# EAGLE design emonPi_v2.0.0-beta (EAGLE 9.6.2)
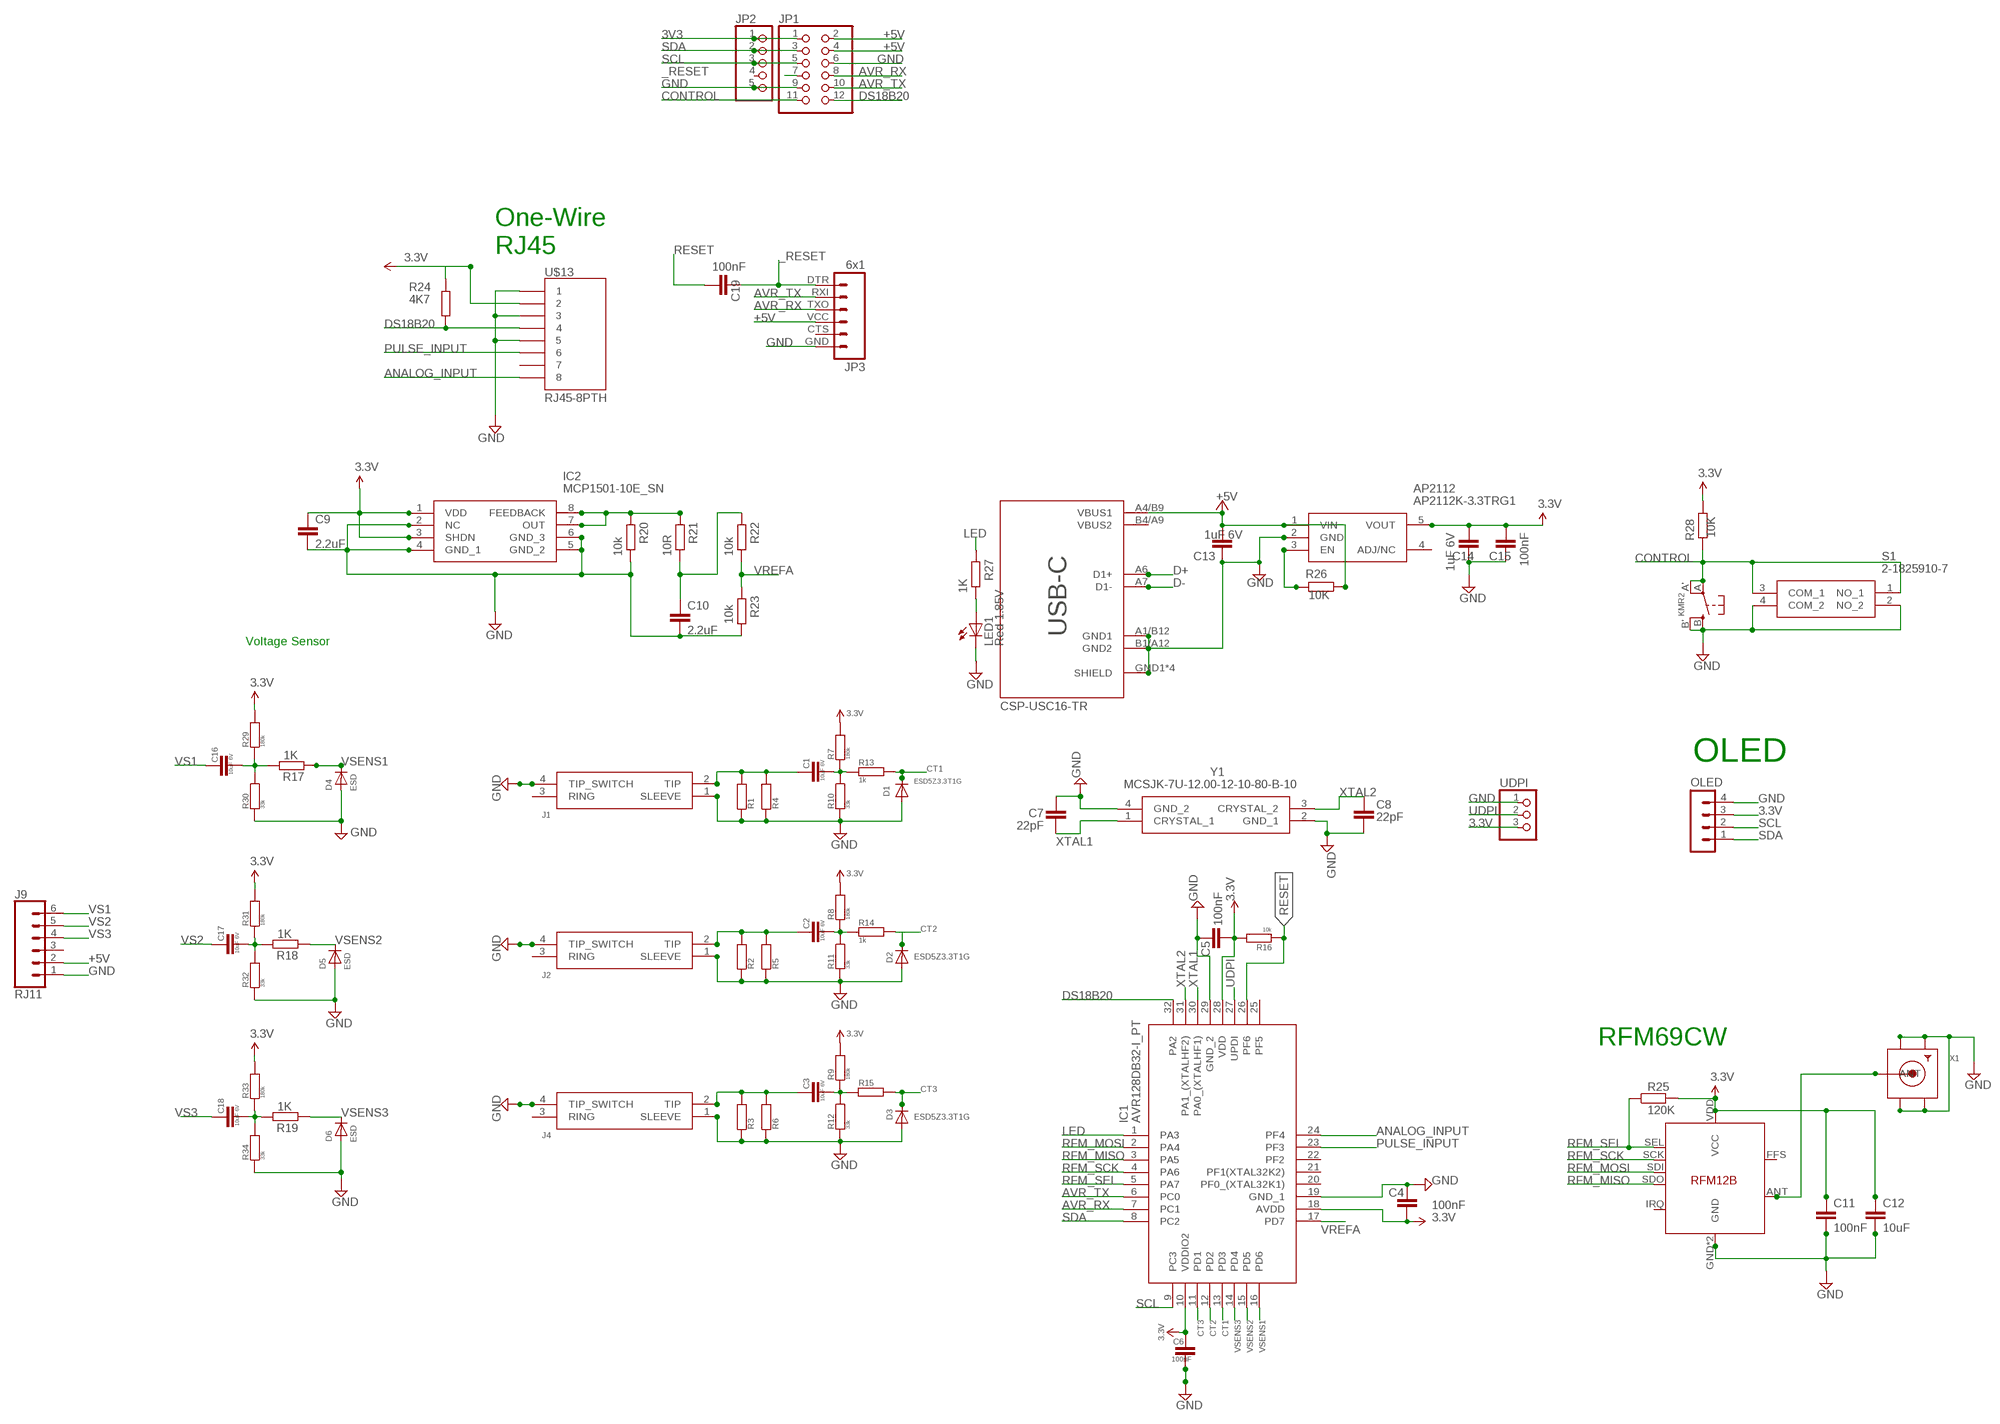
[diagram p0: schematic, sheet 1]

## Parts
AP2112  AP2112K-3.3TRG1  [SOT95P282X130-5N]
C1  10uF 6V  C-EUC0603  [C0603]
C2  10uF 6V  C-EUC0603  [C0603]
C3  10uF 6V  C-EUC0603  [C0603]
C4  100nF  C-EUC0603  [C0603]
C5  100nF  C-EUC0603  [C0603]
C6  100nF  C-EUC0603  [C0603]
C7  22pF  C-EUC0603  [C0603]
C8  22pF  C-EUC0603  [C0603]
C9  2.2uF  C-EUC0603  [C0603]
C10  2.2uF  C-EUC0603  [C0603]
C11  100nF  C-EUC0603  [C0603]
C12  10uF  C-EUC0603  [C0603]
C13  1uF 6V  C-EUC0603  [C0603]
C14  1uF 6V  C-EUC0603  [C0603]
C15  100nF  C-EUC0603  [C0603]
C16  10uF 6V  C-EUC0603  [C0603]
C17  10uF 6V  C-EUC0603  [C0603]
C18  10uF 6V  C-EUC0603  [C0603]
C19  100nF  C-EUC0603  [C0603]
CTRL  KMR2  SWITCH_TACT_SMT4.6X2.8  [BTN_KMR2_4.6X2.8]
D1  ESD5Z3.3T1G  DIODESOD-523  [SOD-523]
D2  ESD5Z3.3T1G  DIODESOD-523  [SOD-523]
D3  ESD5Z3.3T1G  DIODESOD-523  [SOD-523]
D4  ESD  DIODESOD-523  [SOD-523]
D5  ESD  DIODESOD-523  [SOD-523]
D6  ESD  DIODESOD-523  [SOD-523]
IC1  AVR128DB32-I_PT  [QFP80P900X900X120-32N]
IC2  MCP1501-10E_SN  [SOIC127P600X175-8N]
J1  SJ-3524-SMT-TR  [SJ-3524-SMT-TR]
J2  SJ-3524-SMT-TR  [SJ-3524-SMT-TR]
J4  SJ-3524-SMT-TR  [SJ-3524-SMT-TR]
J9  RJ11  RJ11-6  [RJ11-6]
JP1  PINHD-2X6  [2X06]
JP2  PINHD-1X5  [1X05]
JP3  6x1  FTDI_BASICPTH  [FTDI_BASIC]
LED1  Red 1.85V  LEDCHIP-LED0805  [CHIP-LED0805]
OLED  MA04-1-OLEDOLED  [MA04-1-OLED]
R1  R-EU_R1206  [R1206]
R2  R-EU_R1206  [R1206]
R3  R-EU_R1206  [R1206]
R4  R-EU_0204/7  [0204/7]
R5  R-EU_0204/7  [0204/7]
R6  R-EU_0204/7  [0204/7]
R7  180k  R-EU_R0603  [R0603]
R8  180k  R-EU_R0603  [R0603]
R9  180k  R-EU_R0603  [R0603]
R10  33k  R-EU_R0603  [R0603]
R11  33k  R-EU_R0603  [R0603]
R12  33k  R-EU_R0603  [R0603]
R13  1k  R-EU_R0603  [R0603]
R14  1k  R-EU_R0603  [R0603]
R15  1k  R-EU_R0603  [R0603]
R16  10k  R-EU_R0603  [R0603]
R17  1K  R-EU_R0603  [R0603]
R18  1K  R-EU_R0603  [R0603]
R19  1K  R-EU_R0603  [R0603]
R20  10k  R-EU_R0603  [R0603]
R21  10R  R-EU_R0603  [R0603]
R22  10k  R-EU_R0603  [R0603]
R23  10k  R-EU_R0603  [R0603]
R24  4K7  R-EU_R0603  [R0603]
R25  120K  R-EU_R0603  [R0603]
R26  10K  R-EU_R0603  [R0603]
R27  1K  R-EU_R0603  [R0603]
R28  10K  R-EU_R0603  [R0603]
R29  180k  R-EU_R0603  [R0603]
R30  33k  R-EU_R0603  [R0603]
R31  180k  R-EU_R0603  [R0603]
R32  33k  R-EU_R0603  [R0603]
R33  180k  R-EU_R0603  [R0603]
R34  33k  R-EU_R0603  [R0603]
S1  2-1825910-7  [218259107]
U$13  RJ45-8PTH  [RJ45-8]
U$14  RFM12B  [RFM12B]
UDPI  PINHD-1X3  [1X03]
USB-C  CSP-USC16-TR  [USB-C]
X1  SMACONNECTOR  [SMA90_DIP]
Y1  MCSJK-7U-12.00-12-10-80-B-10  [MCSJK7U1200121080B10]

## Nets
3.3V: AP2112.5(VOUT) C4.1 C5.2 C6.1 C9.1 C11.1 C12.1 C14.2 C15.2 IC1.10(VDDIO2) IC1.18(AVDD) IC1.28(VDD) IC2.1(VDD) IC2.3(SHDN) OLED.3 R7.2 R8.2 R9.2 R16.2 R24.1 R25.2 R28.1 R29.2 R31.2 R33.2 U$13.2 U$14.VDD(VCC) UDPI.3
3V3: JP1.1 JP2.1
+5V [power]: AP2112.1(VIN) C13.2 J9.2 JP1.2 JP1.4 JP3.VCC R26.1 USB-C.A4/B9(VBUS1)
_RESET: C19.1 JP1.7 JP3.DTR
ANALOG_INPUT: IC1.24(PF4) U$13.8
AVR_RX: IC1.7(PC1) JP1.8 JP3.TXO
AVR_TX: IC1.6(PC0) JP1.10 JP3.RXI
CONTROL: CTRL.A'(P1) CTRL.A(P) JP1.11 R28.2 S1.1(NO_1) S1.3(COM_1)
CT1: D1.K(C) IC1.13(PD3) R13.2
CT2: D2.K(C) IC1.12(PD2) R14.2
CT3: D3.K(C) IC1.11(PD1) R15.1
D+: USB-C.A6(D1+)
D-: USB-C.A7(D1-)
DIG1: U$14.ANT X1.ANTENNA(ANT)
DS18B20: IC1.32(PA2) JP1.12 R24.2 U$13.4
GND [gnd]: AP2112.2(GND) C4.2 C5.1 C6.2 C7.1 C8.2 C9.2 C10.2 C11.2 C12.2 C13.1 C14.1 C15.1 CTRL.B'(S1) CTRL.B(S) D1.A D2.A D3.A D4.A D5.A D6.A IC1.19(GND_1) IC1.29(GND_2) IC2.2(NC) IC2.4(GND_1) IC2.5(GND_2) IC2.6(GND_3) J1.1(SLEEVE) J1.4(TIP_SWITCH) J2.1(SLEEVE) J2.4(TIP_SWITCH) J4.1(SLEEVE) J4.4(TIP_SWITCH) J9.1 JP1.6 JP1.9 JP2.5 JP3.GND LED1.C OLED.4 R1.1 R2.1 R3.1 R4.1 R5.1 R6.1 R10.2 R11.2 R12.2 R20.1 R23.1 R30.2 R32.1 R34.1 S1.2(NO_2) S1.4(COM_2) U$13.1 U$13.3 U$13.5 U$14.GND U$14.P$12(GND) UDPI.1 USB-C.A1/B12(GND1) USB-C.B1/A12(GND2) USB-C.GND1(SHIELD) USB-C.GND2(SHIELD) USB-C.GND3(SHIELD) USB-C.GND4(SHIELD) X1.GND1 X1.GND2 X1.GND3 X1.GND4 Y1.2(GND_1) Y1.4(GND_2)
LED: IC1.1(PA3) R27.2
N$1: C1.1 J1.2(TIP) R1.2 R4.2
N$2: C16.2 R17.2 R29.1 R30.1
N$3: C3.1 J4.2(TIP) R3.2 R6.2
N$4: C17.2 R18.2 R31.1 R32.2
N$12: C18.2 R19.2 R33.1 R34.2
N$13: C2.1 J2.2(TIP) R2.2 R5.2
N$14: C10.1 R21.1 R22.2
N$15: AP2112.3(EN) R26.2
N$16: C2.2 R8.1 R11.1 R14.1
N$18: C1.2 R7.1 R10.1 R13.1
N$21: C3.2 R9.1 R12.1 R15.2
N$27: IC2.7(OUT) IC2.8(FEEDBACK) R20.2 R21.2
N$41: LED1.A R27.1
PULSE_INPUT: IC1.23(PF3) U$13.6
RESET: C19.2 IC1.26(PF6) R16.1
RFM_MISO: IC1.3(PA5) U$14.SDO
RFM_MOSI: IC1.2(PA4) U$14.SDI
RFM_SCK: IC1.4(PA6) U$14.SCK
RFM_SEL: IC1.5(PA7) R25.1 U$14.SEL
SCL: IC1.9(PC3) JP1.5 JP2.3 OLED.2
SDA: IC1.8(PC2) JP1.3 JP2.2 OLED.1
UDPI: IC1.27(UPDI) UDPI.2
VREFA: IC1.17(PD7) R22.1 R23.2
VS1: C16.1 J9.6
VS2: C17.1 J9.5
VS3: C18.1 J9.4
VSENS1: D4.K(C) IC1.16(PD6) R17.1
VSENS2: D5.K(C) IC1.15(PD5) R18.1
VSENS3: D6.K(C) IC1.14(PD4) R19.1
XTAL1: C7.2 IC1.30(PA0_(XTALHF1)) Y1.1(CRYSTAL_1)
XTAL2: C8.1 IC1.31(PA1_(XTALHF2)) Y1.3(CRYSTAL_2)
Unconnected: AP2112.4(ADJ/NC) IC1.20(PF0_(XTAL32K1)) IC1.21(PF1(XTAL32K2)) IC1.22(PF2) IC1.25(PF5) J1.3(RING) J2.3(RING) J4.3(RING) J9.3 JP2.4 JP3.CTS U$13.7 U$14.FFS U$14.IRQ USB-C.B4/A9(VBUS2)

## Notes on the sheet
- One-Wire
  RJ45
- Voltage Sensor
- OLED
- RFM69CW

## Library data of the parts
AP2112 = AP2112K-3.3TRG1:AP2112K-3.3TRG1: 600mA 3.3V LDO Regulator Enable SOT23-5 DiodesZetex AP2112K-3.3TRG1, LDO Voltage Regulator, 3.3 V +/-1.5%, 2.5 6 Vin, 5-Pin SOT-23 Source: Datasheet <http://uk.rs-online.com/web/p/products/8283509>; ARROW_PART_NUMBER: AP2112K-3.3TRG1; ARROW_PRICE-STOCK: https://www.arrow.com/en/products/ap2112k-3.3trg1/diodes-incorporated?region=nac; DESCRIPTION: 600mA 3.3V LDO Regulator Enable SOT23-5 DiodesZetex AP2112K-3.3TRG1, LDO Voltage Regulator, 3.3 V +/-1.5%, 2.5 6 Vin, 5-Pin SOT-23; HEIGHT: 1.3mm; MANUFACTURER_NAME: Diodes Inc.; MANUFACTURER_PART_NUMBER: AP2112K-3.3TRG1; MOUSER_PART_NUMBER: 621-AP2112K-3.3TRG1; MOUSER_PRICE-STOCK: https://www.mouser.co.uk/ProductDetail/Diodes-Incorporated/AP2112K-33TRG1?qs=x6A8l6qLYDDPYHosCdzh%2FA%3D%3D
C1-C3 C6-C8 C13-C19 = resistor:C-EU: CAPACITOR, European symbol
C4 C5 C9-C12 = rcl:C-EU: CAPACITOR, European symbol
CTRL = microbuilder:SWITCH_TACT_SMT: SMT Tact Switches 6x6mm - Digikey: P12940SCT-ND KMR2 (4.6x2.8mm) - Digikey: 401-1426-1-ND EVQ-PQHB55 - Light Touch, 160GF (4.5x4.5mm) - Digikey: P8090SCT-ND KMT0 - KMT021 NGJ LHS (etc.) IP68/Waterproof - Digikey: CKN10289CT-ND
D1-D6 = microbuilder:DIODE: Diode SMA Model Volts Amps Type Vf Vr Digikey # Notes SSA34-E3 40V 3A Schottky 480mV @ 3A 200uA @ 40V SSA34-E3/61TGITR-ND CDBA120-G 20V 1A Schottky 500mV @ 1A 500uA @ 20V 641-1014-6-ND REEL MBRA210 10V 2A Schottky 350mV @ 2A 700uA @ 10V MBRA210LT3 SOD-123 Model Volts Amps Type Vf Vr Order # Notes BAT54T1G 30V 200mA Schottky 800mV @ 200mA 2uA @ 25V BAT54T1GOSTR-ND B0530W 30V 500mA Schottky 430mV @ 500mA 130uA @ 30V B0530W-FDICT-ND REEL MBR120 1A 20V Schottky 340mV @ 1A MBR120VLSFT1GOSCT-ND SOD-323 Model Volts Amps Type Vf Vr Order # Notes PMEG2005EJ 20V 500mA Schottky 355mV @ 500mA 568-4110-1-ND ZLLS410 10V 570mA Schottky 380mV @ 570mA ZLLS410CT-ND 1N4148WS 75V 150mA Silicon/Simple 1V 1N4148WSFSCT-ND REEL SOD-523 Model Volts Amps Type Vf Vr Order # Notes BAT54XV2 30V 200mA Schottky 0.8V @ 100mA BAT54XV2CT-ND TB751S 30V 30mA Schottky RB751S-40TE61CT-ND SOT23-R/W (R = Solder Paste/Reflow Ovens, W = Hand-Soldering) Model Volts Amps Type Vf Vr Order # Notes BAT54FILM 40V 300mA Schottky 497-7162-1-ND
IC1 = AVR128DB32-I_PT:AVR128DB32-I_PT: 128KB, TQFP32, 85C, 24MHZ, 12B ADC, COMP, OPAMP, MVIO, ZCD, DAC, UART, SPI, TWI, 32 TQFP 7X7X1MM TRAY ROHS COMPLIANT: YES Source: Datasheet <http://ww1.microchip.com/downloads/en/DeviceDoc/AVR128DB28-32-48-64-DataSheet-DS40002247A.pdf>; ARROW_PART_NUMBER: AVR128DB32-I/PT; ARROW_PRICE-STOCK: https://www.arrow.com/en/products/avr128db32-ipt/microchip-technology?region=nac; DESCRIPTION: 128KB, TQFP32, 85C, 24MHZ, 12B ADC, COMP, OPAMP, MVIO, ZCD, DAC, UART, SPI, TWI, 32 TQFP 7X7X1MM TRAY ROHS COMPLIANT: YES; HEIGHT: 1.2mm; MANUFACTURER_NAME: Microchip; MANUFACTURER_PART_NUMBER: AVR128DB32-I/PT; MOUSER_PART_NUMBER: 579-AVR128DB32-I/PT; MOUSER_PRICE-STOCK: https://www.mouser.co.uk/ProductDetail/Microchip-Technology/AVR128DB32-I-PT?qs=vmHwEFxEFR%252BrKeBb9KOKBg%3D%3D
IC2 = MCP1501-10E_SN:MCP1501-10E_SN: MICROCHIP - MCP1501-10E/SN - VOLTAGE REF, SERIES, 1.024V, NSOIC-8 Source: Datasheet <http://www.farnell.com/datasheets/2015662.pdf>; ARROW_PART_NUMBER: MCP1501-10E/SN; ARROW_PRICE-STOCK: https://www.arrow.com/en/products/mcp1501-10esn/microchip-technology; DESCRIPTION: MICROCHIP - MCP1501-10E/SN - VOLTAGE REF, SERIES, 1.024V, NSOIC-8; HEIGHT: 1.75mm; MANUFACTURER_NAME: Microchip; MANUFACTURER_PART_NUMBER: MCP1501-10E/SN; MOUSER_PART_NUMBER: 579-MCP1501-10E/SN; MOUSER_PRICE-STOCK: https://www.mouser.co.uk/ProductDetail/Microchip-Technology/MCP1501-10E-SN?qs=BA62vJVifGrukY%252BvRXgfwQ%3D%3D
J1 J2 J4 = SJ-3524-SMT-TR:SJ-3524-SMT-TR: Phone Connectors Audio Jacks Source: Datasheet <https://datasheet.datasheetarchive.com/originals/distributors/Datasheets-DGA1/151896.pdf>; ARROW_PART_NUMBER: SJ-3524-SMT-TR; ARROW_PRICE-STOCK: https://www.arrow.com/en/products/sj-3524-smt-tr/cui-devices?region=nac; DESCRIPTION: Phone Connectors Audio Jacks; HEIGHT: mm; MANUFACTURER_NAME: CUI Inc.; MANUFACTURER_PART_NUMBER: SJ-3524-SMT-TR; MOUSER_PART_NUMBER: 490-SJ-3524-SMT-TR; MOUSER_PRICE-STOCK: https://www.mouser.co.uk/ProductDetail/CUI-Devices/SJ-3524-SMT-TR?qs=WyjlAZoYn50%252B7OcNbxvx%252BA%3D%3D
J9 = SparkFun-Connectors:RJ11-6: RJ11 Jack - 6 pin Commonly found on CAT3 devices and some Microchip programmers. Here is the connector we sell at SparkFun: RJ11 6-Pin Connector <https://www.sparkfun.com/products/132> (PRT-00132) Datasheet <http://www.sparkfun.com/datasheets/Prototyping/Connectors/RJ11-Datasheet.pdf> It is used on this SparkFun product: SparkFun Weather Shield <https://www.sparkfun.com/products/12081> (DEV-12081) Weather Meters <https://www.sparkfun.com/products/8942> (SEN-08942); PROD_ID: CONN-08590; SF_ID: PRT-00132
JP1 = pinhead:PINHD-2X6: PIN HEADER
JP2 = pinhead:PINHD-1X5: PIN HEADER
JP3 = SparkFun:FTDI_BASIC: FTDI Basic: 3.3V and 5V
LED1 = adafruit:LED: LED OSRAM: - CHIPLED LG R971, LG N971, LY N971, LG Q971, LY Q971, LO R971, LY R971 LH N974, LH R974 LS Q976, LO Q976, LY Q976 LO Q996 - Hyper CHIPLED LW Q18S LB Q993, LB Q99A, LB R99A - SideLED LS A670, LO A670, LY A670, LG A670, LP A670 LB A673, LV A673, LT A673, LW A673 LH A674 LY A675 LS A676, LA A676, LO A676, LY A676, LW A676 LS A679, LY A679, LG A679 - Hyper Micro SIDELED® LS Y876, LA Y876, LO Y876, LY Y876 LT Y87S - SmartLED LW L88C, LW L88S LB L89C, LB L89S, LG L890 LS L89K, LO L89K, LY L89K LS L896, LA L896, LO L896, LY L896 - TOPLED LS T670, LO T670, LY T670, LG T670, LP T670 LSG T670, LSP T670, LSY T670, LOP T670, LYG T670 LG T671, LOG T671, LSG T671 LB T673, LV T673, LT T673, LW T673 LH T674 LS T676, LA T676, LO T676, LY T676, LB T676, LH T676, LSB T676, LW T676 LB T67C, LV T67C, LT T67C, LS T67K, LO T67K, LY T67K, LW E67C LS E67B, LA E67B, LO E67B, LY E67B, LB E67C, LV E67C, LT E67C LW T67C LS T679, LY T679, LG T679 LS T770, LO T770, LY T770, LG T770, LP T770 LB T773, LV T773, LT T773, LW T773 LH T774 LS E675, LA E675, LY E675, LS T675 LS T776, LA T776, LO T776, LY T776, LB T776 LHGB T686 LT T68C, LB T68C - Hyper Mini TOPLED® LB M676 - Mini TOPLED Santana® LG M470 LS M47K, LO M47K, LY M47K Source: http://www.osram.convergy.de/
OLED = con-lstb-db:MA04-1-OLED: PIN HEADER with OLED footprint.
R1-R34 = rcl:R-EU_: RESISTOR, European symbol
S1 = 2-1825910-7:2-1825910-7: Relays, Contactors & Switches Switches Tactile Switches FSM14JH=6MM TACT SWITCH, HIGH TEMP Source: Datasheet <http://www.te.com/commerce/DocumentDelivery/DDEController?Action=showdoc&DocId=Customer Drawing1825910C10pdfEnglishENG_CD_1825910_C10.pdf2-1825910-7>; ARROW_PART_NUMBER: 2-1825910-7; ARROW_PRICE-STOCK: https://www.arrow.com/en/products/2-1825910-7/te-connectivity?region=europe; DESCRIPTION: Relays, Contactors & Switches Switches Tactile Switches FSM14JH=6MM TACT SWITCH, HIGH TEMP; HEIGHT: 13mm; MANUFACTURER_NAME: TE Connectivity; MANUFACTURER_PART_NUMBER: 2-1825910-7; MOUSER_PART_NUMBER: 506-2-1825910-7; MOUSER_PRICE-STOCK: https://www.mouser.co.uk/ProductDetail/TE-Connectivity-PB/2-1825910-7?qs=epcAG6di8szpGFLvuwXKeQ%3D%3D
U$13 = SparkFun-Connectors:RJ45-8: RJ45 Jack Simple RJ45, 8-pin connection - connector for common Cat5, Cat5e, and Cat6 Ethernet cables. Footprint not yet proven in production. Connector sku is PRT-00643; Breakout PCB sku is BOB-00716.
U$14 = JeeParts:RFM12B
UDPI = adafruit:PINHD-1X3: PIN HEADER
USB-C = CSP-USC16-TR:CSP-USC16-TR: CSP-USC16-TR TOBY.CO.UK; MPN: CSP-USC16-TR
X1 = adafruit:SMACONNECTOR: SMA Connector 90° DIP SMA Connector, 50 Ohm (4UConnector: 07259)
Y1 = MCSJK-7U-12.00-12-10-80-B-10:MCSJK-7U-12.00-12-10-80-B-10: CRYSTAL, 12MHZ, 12PF, 3.2MM X 2.5MM Source: Datasheet <https://componentsearchengine.com/Datasheets/2/MCSJK-7U-12.00-12-10-80-B-10.pdf>; DESCRIPTION: CRYSTAL, 12MHZ, 12PF, 3.2MM X 2.5MM; HEIGHT: 0.8mm; MANUFACTURER_NAME: MULTICOMP; MANUFACTURER_PART_NUMBER: MCSJK-7U-12.00-12-10-80-B-10

## Net classes
0 default: width 0.203 mm, drill 0.6 mm, clearance 0.203 mm
1 power: width 0.305 mm, drill 0.6 mm, clearance 0.254 mm
2 gnd: width 0.254 mm, drill 0.6 mm, clearance 0.254 mm
3 5V0_PI: width 0.406 mm, drill 0.4 mm
4 3V3_PI: width 0.254 mm, drill 0.4 mm

## Board
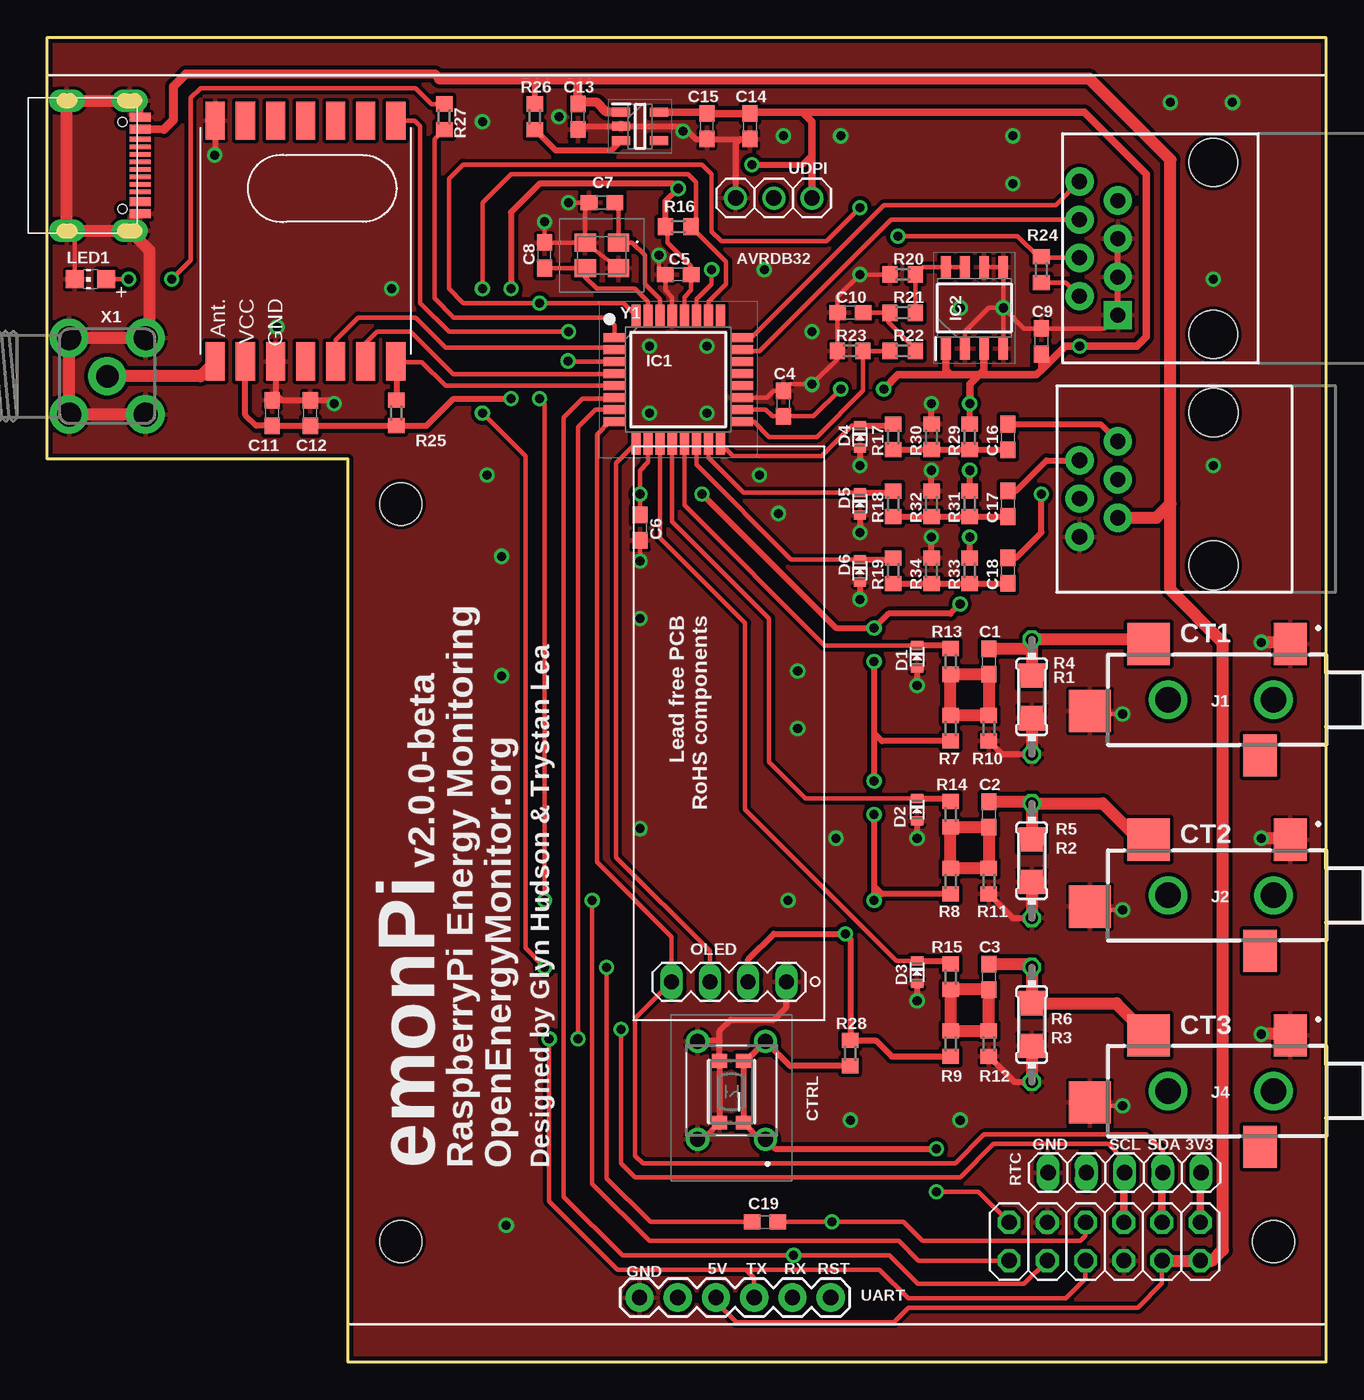
[diagram p1: board, top side]
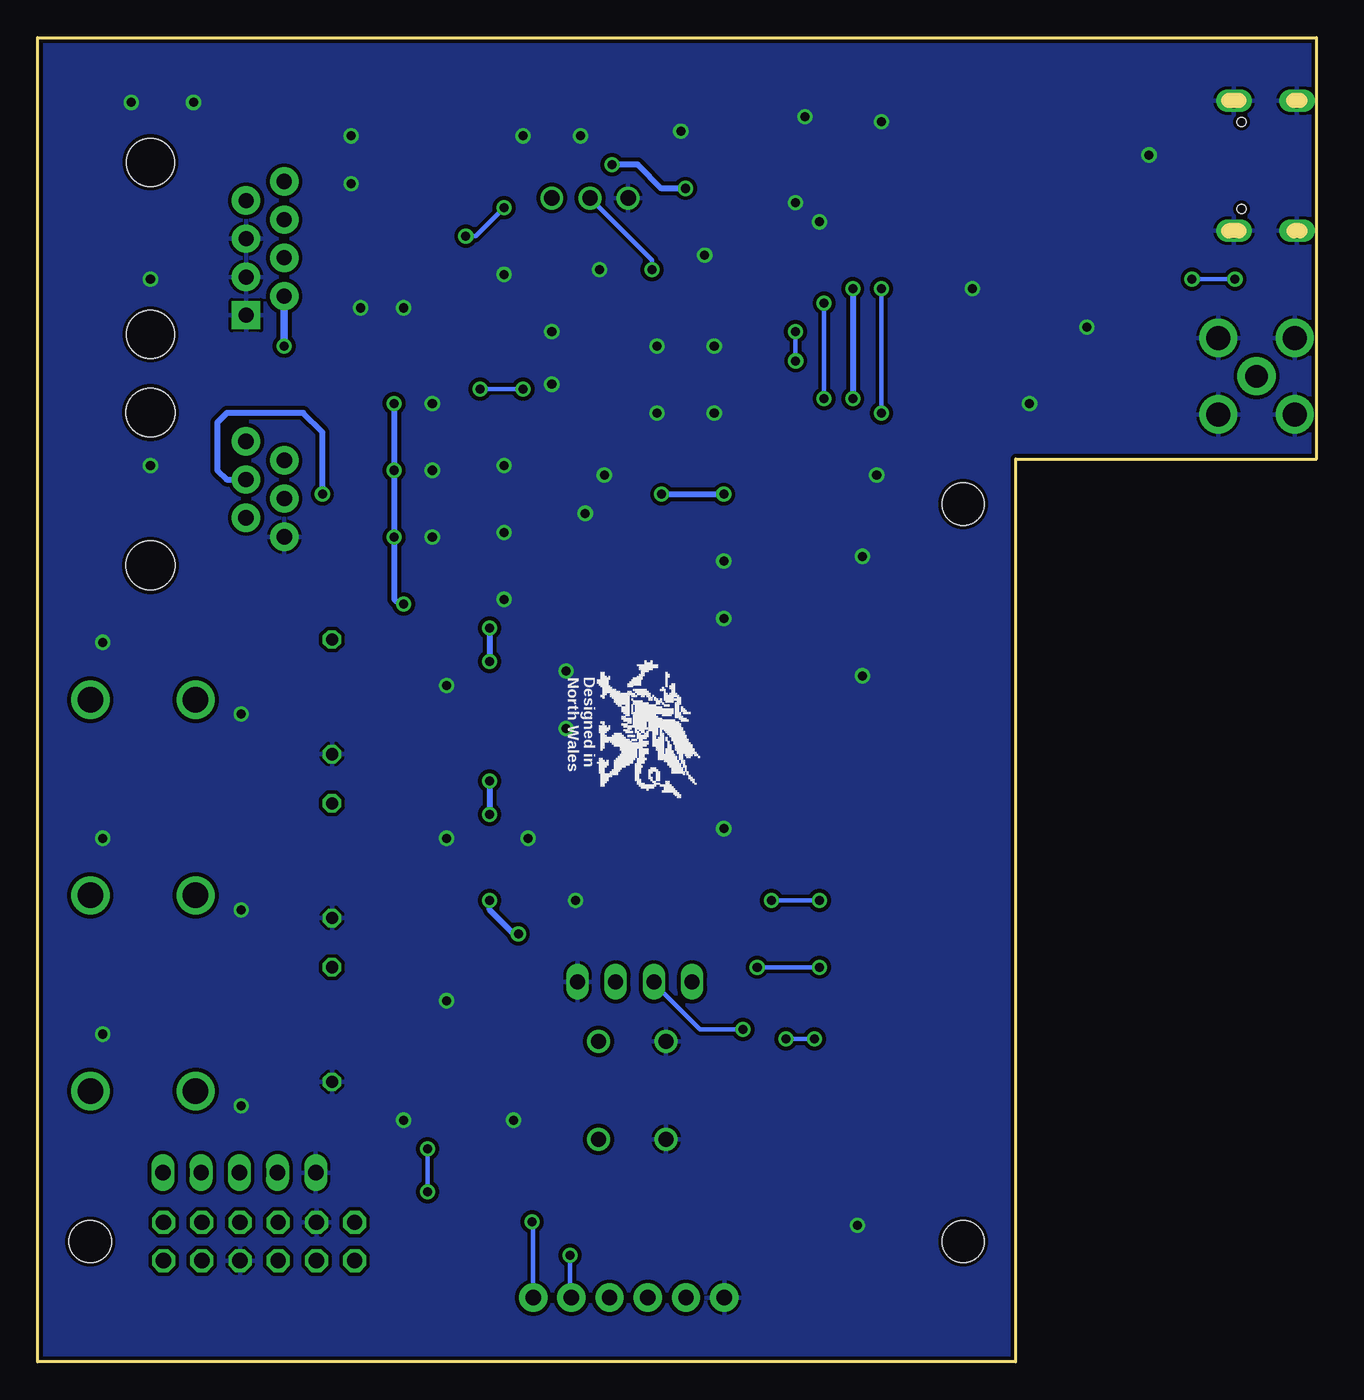
[diagram p2: board, bottom side, seen from below]

Size 85 x 88 mm. Coordinates in mm from the lower left corner, seen from the top.
Outline: 20,0 85,0 85,88 0,88 0,60 20,60 20,0
Copper layers (1*16): Top 8mil / dielectric 8mil / Bottom 8mil
Design rules "default *": minimum track width 8mil, minimum drill 0.5mm, track to track 8mil, track to pad 8mil, pad to pad 8mil, via to via 8mil, smd to smd 8mil, copper to edge 10mil, drill to drill 8mil, minimum pad ring 8mil, minimum via ring 8mil, stop-mask expansion 0.075mm, vias tented up to drill 0.6mm, thermal gap 8mil
Holes 2.8 mm at 23.5,8 81.5,8 23.5,57

### Footprints (pad centres in the part's own frame; a part is rotated, then mirrored left to right if it is on the bottom)
SOT95P282X130-5N = smd 1.2 x 0.6: 1 -1.25,0.95; 2 -1.25,0; 3 -1.25,-0.95; 4 1.25,-0.95; 5 1.25,0.95
C0603 = smd 1.1 x 1: 1 -0.85,0; 2 0.85,0
BTN_KMR2_4.6X2.8 = smd 0.9 x 1: A 2.05,0.8; A' -2.05,0.8; B 2.05,-0.8; B' -2.05,-0.8
SOD-523 = smd 0.8 x 0.6: A 0,-0.75; K 0,0.75
QFP80P900X900X120-32N = smd 1.475 x 0.6: 1 -4.238,2.8; 2 -4.238,2; 3 -4.238,1.2; 4 -4.238,0.4; 5 -4.238,-0.4; 6 -4.238,-1.2; 7 -4.238,-2; 8 -4.238,-2.8; 17 4.238,-2.8; 18 4.238,-2; 19 4.238,-1.2; 20 4.238,-0.4; 21 4.238,0.4; 22 4.238,1.2; 23 4.238,2; 24 4.238,2.8 | smd 0.6 x 1.475: 9 -2.8,-4.238; 10 -2,-4.238; 11 -1.2,-4.238; 12 -0.4,-4.238; 13 0.4,-4.238; 14 1.2,-4.238; 15 2,-4.238; 16 2.8,-4.238; 25 2.8,4.238; 26 2,4.238; 27 1.2,4.238; 28 0.4,4.238; 29 -0.4,4.238; 30 -1.2,4.238; 31 -2,4.238; 32 -2.8,4.238
SOIC127P600X175-8N = smd 1.5 x 0.65: 1 -2.7,1.905; 2 -2.7,0.635; 3 -2.7,-0.635; 4 -2.7,-1.905; 5 2.7,-1.905; 6 2.7,-0.635; 7 2.7,0.635; 8 2.7,1.905
SJ-3524-SMT-TR = smd 2.2 x 2.8: 1 2.4,-6.7; 3 4.4,0.7 | smd 2.8 x 2.8: 2 11.8,-6.7; 4 15.7,-2.25 | drill 1.7 pad 2.55: 5 3.5,-3; 6 10.5,-3
RJ11-6 = drill 1.016 pad 1.88: 1 -3.175,8.89; 2 -1.905,6.35; 3 -0.635,8.89; 4 0.635,6.35; 5 1.905,8.89; 6 3.175,6.35 | hole 3.251: -5.08,0; 5.08,0
2X06 = drill 1.016 octagon: 1 -6.35,-1.27; 2 -6.35,1.27; 3 -3.81,-1.27; 4 -3.81,1.27; 5 -1.27,-1.27; 6 -1.27,1.27; 7 1.27,-1.27; 8 1.27,1.27; 9 3.81,-1.27; 10 3.81,1.27; 11 6.35,-1.27; 12 6.35,1.27
1X05 = drill 1.016 long: 1 -5.08,0; 2 -2.54,0; 3 0,0; 4 2.54,0; 5 5.08,0
FTDI_BASIC = drill 1.016 pad 1.88: CTS 10.16,0; DTR 0,0; GND 12.7,0; RXI 2.54,0; TXO 5.08,0; VCC 7.62,0
CHIP-LED0805 = smd 1.2 x 1.2: A 0,-1.05; C 0,1.05
MA04-1-OLED = drill 1 long: 1 -3.81,0; 2 -1.27,0; 3 1.27,0; 4 3.81,0
R1206 = smd 1.6 x 1.803: 1 -1.422,0; 2 1.422,0
0204/7 = drill 0.813 octagon: 1 -3.81,0; 2 3.81,0
R0603 = smd 1 x 1.1: 1 -0.85,0; 2 0.85,0
218259107 = drill 0.99 pad 1.54: 1 2.76,2.25; 2 2.76,-2.25; 3 -3.74,2.25; 4 -3.74,-2.25
RJ45-8 = drill 1 pad 1.88 square: 1 -4.445,6.35 | drill 1 pad 1.88: 2 -3.175,8.89; 3 -1.905,6.35; 4 -0.635,8.89; 5 0.635,6.35; 6 1.905,8.89; 7 3.175,6.35; 8 4.445,8.89 | hole 3.2: -5.715,0; 5.715,0
RFM12B = smd 2.54 x 1.27: ANT 8,-6; FFS -8,2; GND 8,-2; IRQ -8,4; P$8 -8,0; P$9 -8,-2; P$10 -8,-4; P$12 -8,-6; P$16 8,0; SCK 8,4; SDI 8,2; SDO -8,6; SEL 8,6; VDD 8,-4
1X03 = drill 1.016: 1 -2.54,0; 2 0,0; 3 2.54,0
USB-C = smd 0.6 x 1.4: A1/B12 -3.2,0.7; A4/B9 -2.4,0.7; B1/A12 3.2,0.7; B4/A9 2.4,0.7 | smd 0.3 x 1.4: A5 -1.25,0.7; A6 -0.25,0.7; A7 0.25,0.7; A8 1.25,0.7; B5 1.75,0.7; B6 0.75,0.7; B7 -0.75,0.7; B8 -1.75,0.7 | drill 1 pad 1.2 long: GND1 -4.32,0; GND2 4.33,0; GND3 4.33,-4.18; GND4 -4.32,-4.18 | hole 0.6: -2.89,-0.5; 2.89,-0.5
SMA90_DIP = drill 1.5 pad 2.54: ANTENNA 0,0 | drill 1.6 pad 2.54: GND1 -2.54,2.54; GND2 2.54,2.54; GND3 -2.54,-2.54; GND4 2.54,-2.54
MCSJK7U1200121080B10 = smd 1.4 x 1.2: 1 -1.1,-0.85; 2 1.1,-0.85; 3 1.1,0.85; 4 -1.1,0.85

### Placement (x,y rotation side)
AP2112  39.4,82.11 0 top
C1  62.58,46.55 270 top
C2  62.58,36.38 270 top
C3  62.58,25.59 270 top
C4  48.93,63.69 90 top
C5  41.94,72.26 0 top
C6  39.4,55.44 270 top
C7  36.86,77.03 0 top
C8  33.05,73.53 90 top
C9  66.07,67.82 90 top
C10  53.37,69.72 180 top
C11  14.95,63.05 90 top
C12  17.5,63.05 90 top
C13  35.27,82.74 90 top
C14  46.7,82.11 90 top
C15  43.85,82.11 90 top
C16  63.85,61.47 270 top
C17  63.85,57.02 270 top
C18  63.85,52.58 270 top
C19  47.7,9.3 180 top
CTRL  45.48,17.95 270 top
D1  57.82,46.86 0 top
D2  57.82,36.7 0 top
D3  57.82,25.91 0 top
D4  54.01,61.47 0 top
D5  54.01,57.02 0 top
D6  54.01,52.58 0 top
IC1  41.94,65.28 0 top
IC2  61.63,70.04 90 top
J1  85,41 180 top
J2  85,28 180 top
J4  85,15 180 top
J9  77.5,58 90 top
JP1  70.28,8 180 top
JP2  71.6,12.57 180 top
JP3  52.07,4.27 180 top
LED1  2.89,71.94 90 top
OLED  45.32,25.25 0 top
R1  65.44,44.2 90 top
R2  65.44,33.3 90 top
R3  65.44,22.41 90 top
R4  65.44,44.2 90 top
R5  65.44,33.3 90 top
R6  65.44,22.41 90 top
R7  60.04,42.1 270 top
R8  60.04,31.94 270 top
R9  60.04,21.14 270 top
R10  62.58,42.1 270 top
R11  62.58,31.94 270 top
R12  62.58,21.14 270 top
R13  60.04,46.55 90 top
R14  60.04,36.38 90 top
R15  60.04,25.59 270 top
R16  41.94,75.44 180 top
R17  56.23,61.47 270 top
R18  56.23,57.02 270 top
R19  56.23,52.58 270 top
R20  56.87,72.26 0 top
R21  56.87,69.72 0 top
R22  56.87,67.18 0 top
R23  53.37,67.18 0 top
R24  66.07,72.58 90 top
R25  23.21,63.05 270 top
R26  32.42,82.74 270 top
R27  26.39,82.74 270 top
R28  53.37,20.51 270 top
R29  61.31,61.47 90 top
R30  58.77,61.47 90 top
R31  61.31,57.02 90 top
R32  58.77,57.02 270 top
R33  61.31,52.58 90 top
R34  58.77,52.58 270 top
S1  45.48,17.56 270 top
U$13  77.5,74 90 top
U$14  17.18,74.48 270 top
UDPI  48.29,77.34 0 top
USB-C  5.5,79.5 270 top
X1  4,65.5 90 top
Y1  36.86,73.53 180 top

### Tracks (layer width: path | path; a pad name or v marks a point on that pad's centre or on a via)
3.3V  (via drill 0.6)
  Top 0.305: IC1.28 42.34,70.76 42.79,71.21 C5.2 42.79,72.81 41.22,74.38 41.22,75.31 R16.2 | IC2.1 59.72,67.18 | U$14.VDD 13.47,66.19 | C6.1 v39.4,57.66 39.4,59.24 39.94,59.78 IC1.10 | U$13.2 67.7,71.73 R24.1 | 55.28,83.06 54.96,83.06 | IC1.18 47.75,63.28 48.19,62.84 C4.1 50.94,62.84 v52.74,64.64 | C9.1 66.17,66.86 | 66.07,65.91 66.11,65.95
  Top 0.406: AP2112.5 40.67,83.08 | 54.96,36.28 v54.96,36.38 54.96,31.62 | v54.96,46.55 54.96,41.78 | 54.96,41.78 v54.96,38.61 | C14.2 46.76,82.9 | 59.72,67.5 59.72,67.18 | U$14.VDD 13.18,62.93 13.9,62.2 C11.1 C12.1 R25.2 25.22,62.2 27.02,64.01 v30.83,64.01 | v46.83,79.56 50.2,79.56 50.83,80.2 | R16.2 41.09,77.13 v41.94,77.98 41.62,78.3 32.73,78.3 30.83,76.39 v30.83,71.31 | 46.59,26.32 OLED.3 46.59,26.74 48.29,28.45 v53.05,28.45 53.37,28.13 R28.1 55.06,21.36 56.13,20.3 R9.2 | 54.96,31.62 v54.96,30.67 | R7.2 55.49,41.25 54.96,41.78 | R8.2 55.49,31.09 54.96,31.62 | R33.2 v61.31,54.8 | R31.2 v61.31,59.24 | R29.2 v61.31,63.69 | v60.67,50.35 60.04,49.72 55.91,49.72 v54.96,48.77 52.42,48.77 v43.53,57.66
  Top 0.508: AP2112.5 43.75,83.06 C15.2 C14.2 46.81,83.06 50.2,83.06 | 50.2,83.06 50.83,82.42 50.83,80.2 UDPI.3 | 50.2,83.06 54.96,83.06 68.93,83.06 73.06,78.93 73.06,68.14 72.42,67.5 v68.61,67.5 67.66,67.5 66.11,65.95 | 66.07,66.86 C9.1 66.11,66.93 66.11,65.95 | 66.11,65.95 65.75,65.59 61.94,65.59 | v55.59,64.64 56.55,65.59 60.04,65.59 | 61.94,65.59 60.04,65.59 | v61.31,63.69 61.31,64.96 61.94,65.59 | IC2.3 62.26,65.91 61.94,65.59 | IC2.1 59.72,65.91 60.04,65.59
  Bottom 0.305: v52.74,64.64 v55.59,64.64
  Bottom 0.406: v53.05,28.45 53.37,28.45 54.96,30.04 v54.96,30.67 | v54.96,48.77 v54.96,46.55 | v30.83,71.31 v30.83,64.01 | v41.94,77.98 43.53,77.98 45.12,79.56 v46.83,79.56 | v43.53,57.66 v39.4,57.66 | v54.96,38.61 v54.96,36.38 | v61.31,63.69 v61.31,59.24 v61.31,54.8 61.31,50.67 60.99,50.35 v60.67,50.35
  Bottom 0.508: U$13.2 v68.61,67.5
3V3
  Top 0.508: JP1.1 76.63,12.53 JP2.1
+5V
  Top 0.305: JP1.4 74.09,5.21 72.47,3.59 57.23,3.59 56.28,2.63 45.8,2.63 44.45,3.99 JP3.VCC
  Top 0.406: 38.13,83.08 AP2112.1 | 32.42,83.38 R26.1 32.42,85.28
  Top 0.508: USB-C.A4/B9 7.77,81.9
  Top 0.61: 26.1,85.28 25.78,85.6 9.24,85.6 8.4,84.76 8.4,82.53 7.77,81.9 | AP2112.1 37.18,83.06 36.55,83.69 35.38,83.69 C13.2 35.27,85.28
  Top 0.813: J9.2 73.72,56.09 74.64,57.02 | 74.64,57.02 74.64,79.88 69.25,85.28 35.27,85.28 32.42,85.28 26.1,85.28 | 74.64,57.02 74.64,51.31 78.14,47.81 78.14,7.45 77.42,6.73 JP1.2 JP1.4
_RESET  (via drill 0.6)
  Top 0.305: v52.15,9.3 C19.1 | 52.47,9.3 v52.15,9.3 | v52.15,9.3 56.91,9.3 58.18,8.03 68.66,8.03 69.01,8.38 JP1.7
  Bottom 0.305: v52.15,9.3 52.07,9.22 JP3.DTR
ANALOG_INPUT
  Top 0.305: IC1.24 46.82,68.08 55.6,76.86 67.02,76.86 U$13.8
AVR_RX  (via drill 0.6)
  Top 0.305: v33.37,21.46 33.37,10.67 37.91,6.13 46.44,6.13 | v35.27,21.46 35.27,62.1 36.45,63.28 IC1.7 | JP3.TXO 46.99,5.57 46.44,6.13 | JP1.8 69.01,5.53 67.71,4.22 57.23,4.22 55.33,6.13 46.44,6.13
  Bottom 0.305: v35.27,21.46 v33.37,21.46
AVR_TX  (via drill 0.6)
  Top 0.305: IC1.6 37.63,64.01 35.59,64.01 34.32,62.74 34.32,10.98 38.23,7.08 v49.61,7.08 55.96,7.08 57.87,5.17 64.92,5.17 JP1.10
  Bottom 0.305: v49.61,7.08 49.61,4.35 JP3.RXI
CONTROL  (via drill 0.6)
  Top 0.305: JP1.11 61.9,11.3 v59.09,11.3
  Top 0.406: R28.2 49.37,19.66 S1.3 46.44,20 CTRL.A' CTRL.A 47.39,14.8 S1.1 48.37,14.16 v59.09,14.16
  Bottom 0.305: v59.09,14.16 v59.09,11.3
CT1
  Top 0.305: IC1.13 42.34,56.94 51.67,47.61 D1.K
  Top 0.406: R13.2 59.82,47.61 D1.K
CT2
  Top 0.305: IC1.12 41.54,55.84 47.98,49.4 47.98,39.88 50.4,37.45 D2.K
  Top 0.406: D2.K 59.82,37.45 R14.2
CT3
  Top 0.305: IC1.11 40.74,54.73 46.39,49.09 46.39,36.7 56.43,26.66 D3.K
  Top 0.406: D3.K 59.82,26.66 R15.1
DIG1
  Top 0.813: U$14.ANT 10.19,65.5 X1.ANTENNA
DS18B20  (via drill 0.6)
  Top 0.305: U$13.4 66.14,73.36 R24.2 65.86,73.43 64.48,74.8 v56.55,74.8 | v36.23,30.67 36.23,11.84 40.04,8.03 56.59,8.03 57.9,6.73 JP1.12 | v33.05,30.67 33.05,63.69 v32.73,64.01 | IC1.32 38.3,70.36 v32.73,70.36 27.66,70.36 26.7,71.31 26.7,78.61 27.66,79.56 43.53,79.56 44.16,78.93 44.16,75.12 44.8,74.48 51.78,74.48 v54.01,76.71
  Bottom 0.305: v36.23,30.67 v33.05,30.67 | v32.73,70.36 v32.73,64.01 | v56.55,74.8 55.91,74.8 v54.01,76.71
GND  (via drill 0.6)
  Top 0.305: IC1.19 47.83,64.08 48.29,64.54 C4.2 49.35,64.96 v50.83,64.96 52.52,66.65 R23.1 C10.2 52.52,70.78 v54.01,72.26 R20.1 | IC1.29 41.54,70.76 41.09,71.21 C5.1 40.67,72.68 v40.67,73.53 | Y1.4 Y1.2 | Y1.2 35.76,76.78 C7.1 v34.64,77.03 | Y1.2 C8.2 v33.05,75.75 | IC2.6 IC2.5 v63.53,70.04 | IC2.4 v63.53,70.04 | IC2.2 60.99,68.45 62.58,70.04 v63.53,70.04 | 1.16,83.98 USB-C.GND4 | J2.4 69.52,30.04 v71.47,30.04 | v71.47,43.05 69.5,43.05 J1.4 | J4.4 69.53,17.02 v71.47,17.02 | C6.2 v39.4,53.21 | LED1.C 1.84,74.65 USB-C.GND3 | U$13.1 70.26,68.67 C9.2 64.91,68.67 v63.53,70.04
  Top 0.406: C13.1 35.49,82.11 AP2112.2 42.26,82.11 43.11,81.25 C15.1 C14.1 46.07,81.25 45.75,80.94 UDPI.1 | USB-C.B1/A12 5.5,75.6 USB-C.GND2 | USB-C.A1/B12 6.2,83.12 USB-C.GND1 | 11.25,81.89 11.14,81.79 11.14,82.45 U$14.P$12 11.18,80.23 v11.14,80.2 | U$13.1 U$13.3 U$13.5 | C11.2 15.59,63.91 | 15.59,63.91 C12.2 18.87,63.91 v19.08,63.69 | U$14.GND 15.18,64.32 15.59,63.91 | D3.A v57.82,24 | D2.A v57.82,34.8 | D1.A v57.82,44.96 | R34.1 v58.77,54.8 | D6.A v54.01,50.67 | R32.1 v58.77,59.24 | D5.A v54.01,55.12 | R30.2 v58.77,63.69 | D4.A v54.01,59.56 | R11.2 64.17,29.5 R5.1 | R10.2 63.44,40.38 R4.1 | R12.2 64.27,18.61 R6.1 | OLED.4 49.13,23.57 48.29,22.73 45.44,22.73 44.68,21.98 44.68,21.37 | 44.68,21.37 CTRL.B' CTRL.B 43.58,14.8 S1.2 | S1.4 43.3,21.37 44.68,21.37
  Top 0.813: X1.GND3 X1.GND1 X1.GND2 X1.GND4 6.79,68.29 6.79,73.88 USB-C.GND2 USB-C.GND3 USB-C.GND4 USB-C.GND1 | R1.1 R4.1 | R3.1 R6.1 | R2.1 R5.1 | J1.1 82.48,47.81 v80.68,47.81 | J2.1 82.5,34.8 v80.68,34.8 | J4.1 82.52,21.78 v80.68,21.78
  other vias: 39.4,49.4 29.24,58.93 30.2,45.59 30.2,53.53 22.89,71.31 40.04,67.5 43.85,67.5 43.85,63.05 40.04,63.05 47.34,58.93 48.61,56.39 50.83,68.45 48.93,81.47 52.74,81.47 64.17,81.47 64.17,78.3 42.26,81.79 60.67,70.04 15.27,68.77 74.64,83.69 78.77,83.69 77.5,71.94 77.5,59.56 49.24,30.67 49.88,42.1 49.88,45.91 39.4,35.43 52.42,34.8 53.37,16.06 60.67,16.06 30.51,9.08 47.66,72.58 28.92,82.42 34.01,82.74
  pour Bottom: -1,89 -1,-1 87.5,-1 87.5,89
  pour Top: -2,89 88,89 88,-2 -2,-2
LED
  Top 0.305: R27.2 25.75,81.25 25.75,70.67 27.02,69.41 37.18,69.41 37.7,68.88 IC1.1
N$1
  Top 0.406: 65.22,47.4 65.44,47.18
  Top 0.813: J1.2 72.89,48.01 R4.2 65.44,47.5 | 65.44,47.5 65.44,47.18 R1.2 | C1.1 65.33,47.4 65.44,47.5
N$2
  Top 0.406: R17.2 R30.1 R29.1 C16.2
N$3
  Top 0.305: 73.12,21.78 J4.2
  Top 0.813: C3.1 65.22,26.44 R6.2 R3.2 71.06,23.84 J4.2
N$4
  Top 0.406: R18.2 R32.2 R31.1 C17.2
N$12
  Top 0.406: R19.2 R34.2 R33.1 C18.2
N$13
  Top 0.813: J2.2 72.88,34.38 70.15,37.12 R5.2 | C2.1 65.32,37.23 R5.2 | R5.2 R2.2
N$14
  Top 0.305: 55.91,69.72 R21.1 | R22.2 57.72,67.28 55.91,69.09 55.91,69.72 | C10.1 55.91,69.72
N$15
  Top 0.406: R26.2 33.79,80.52 37.52,80.52 AP2112.3
N$16
  Top 0.813: R14.1 C2.2 R11.1 R8.1 R14.1
N$18
  Top 0.813: R13.1 C1.2 R10.1 R7.1 R13.1
N$21
  Top 0.813: R15.2 R9.1 R12.1 C3.2 R15.2
N$27
  Top 0.305: R21.2 R20.2 58.19,72.74 IC2.8 IC2.7
N$41  (via drill 0.6)
  Top 0.305: v8.29,71.94 9.56,73.22 9.56,84.01 10.19,84.64 24.48,84.64 25.54,83.59 R27.1 | v5.43,71.94 LED1.A
  Bottom 0.305: v5.43,71.94 v8.29,71.94 8.37,71.94
PULSE_INPUT
  Top 0.305: IC1.23 46.28,67.18 47.34,67.18 56.06,75.91 U$13.6
RESET  (via drill 0.6)
  Top 0.305: IC1.26 43.94,70.45 45.12,71.63 45.12,73.11 R16.1 | R16.1 42.9,75.33 | R16.1 42.9,75.54 | R16.1 43.11,75.75 43.11,78.4 42.58,78.93 30.83,78.93 28.92,77.03 v28.92,71.31 | v28.92,63.05 31.78,60.2 31.78,27.5 v33.05,26.23 | v37.18,26.23 37.18,12.21 40.09,9.3 C19.2
  Bottom 0.305: v28.92,71.31 v28.92,63.05 | v33.05,26.23 v37.18,26.23
RFM_MISO  (via drill 0.6)
  Top 0.305: U$14.SDO 24.42,82.48 24.8,82.11 24.8,70.36 26.7,68.45 v34.64,68.45 | v34.62,66.52 34.66,66.48 IC1.3
  Bottom 0.305: v34.64,68.45 34.62,68.44 v34.62,66.52
RFM_MOSI
  Top 0.305: U$14.SDI 19.18,67.91 20.67,69.41 24.48,69.41 26.48,67.41 37.58,67.41 IC1.2
RFM_SCK
  Top 0.305: U$14.SCK 21.18,67.69 21.94,68.45 24.16,68.45 26.99,65.63 37.65,65.63 IC1.4
RFM_SEL
  Top 0.305: IC1.5 26.47,64.88 24.89,66.45 23.21,66.45
  Top 0.406: U$14.SEL 23.21,66.45 R25.1
SCL  (via drill 0.6)
  Top 0.305: OLED.2 44.05,27.3 37.81,33.53 37.81,59.71 IC1.9 | v38.13,22.1 38.13,13.21 39.09,12.26 60.67,12.26 62.9,14.48 70.52,14.48 71.6,13.4 JP2.3 | 71.55,9.32 JP1.5
  Top 0.508: JP1.5 71.55,12.53 JP2.3
  Bottom 0.305: 44.16,25.14 OLED.2 44.05,25.16 40.99,22.1 v38.13,22.1
SDA
  Top 0.305: IC1.8 37.39,62.48 36.55,61.64 36.55,33.21 41.51,28.25 OLED.1 39.09,22.83 39.09,13.71 39.59,13.21 60.36,13.21 62.26,15.11 73.06,15.11 74.14,14.03 JP2.2 | 74.09,9.32 JP1.3
  Top 0.508: JP1.3 74.09,12.53 JP2.2
UDPI  (via drill 0.6)
  Top 0.305: 43.14,70.29 IC1.27 43.14,70.61 44.16,71.63 v44.16,72.58
  Bottom 0.305: v44.16,72.58 44.16,73.22 UDPI.2
VREFA
  Top 0.305: R22.1 R23.2 54.22,64.54 51.15,61.47 47.98,61.47 46.97,62.48 IC1.17
VS1
  Top 0.406: C16.1 70.01,62.32 J9.6
VS2
  Top 0.406: C17.1 64.38,57.87 66.42,59.91 J9.5
VS3  (via drill 0.6)
  Top 0.406: C18.1 64.38,53.43 66.07,55.12 v66.07,57.66
  Bottom 0.406: v66.07,57.66 66.07,61.78 67.34,63.05 72.42,63.05 73.06,62.42 73.06,59.24 72.45,58.63 J9.4
VSENS1
  Top 0.305: IC1.16 45.58,60.2 51.47,60.2 53.49,62.22 D4.K
  Top 0.406: D4.K 56.13,62.22 R17.1
VSENS2
  Top 0.305: IC1.15 43.94,60.1 46.27,57.77 D5.K
  Top 0.406: D5.K 56.13,57.77 R18.1
VSENS3
  Top 0.305: 43.21,60.97 IC1.14 43.14,59.63 49.45,53.33 D6.K
  Top 0.406: D6.K 56.13,53.33 R19.1
XTAL1
  Top 0.305: C7.2 37.96,76.78 Y1.1 38.87,74.38 39.72,73.53 39.72,71.63 40.74,70.61 IC1.30
XTAL2
  Top 0.305: C8.1 Y1.3 35.76,72.09 36.55,71.31 39.09,71.31 39.94,70.45 IC1.31

### Text on the board
tPlace: AVRDB32 | Lead free PCB / RoHS components | CT1 | CT2 | v2.0.0-beta | CT3 | GND | SCL | SDA | 3V3 | emonPi | RaspberryPi Energy Monitoring | OpenEnergyMonitor.org | Designed by Glyn Hudson & Trystan Lea | RTC | GND | 5V | TX | RX | RST | UART
bPlace: Designed in | North Wales
_tsilk: Designed in | North Wales | Made in UK
_bsilk: 165mm ant | 433Mhz | 165mm ant | 165mm ant | 433Mhz | 433Mhz | 868Mhz | 82mm ant | 82mm ant | 82mm ant | 868Mhz | 868Mhz | 78mm ant | 915Mhz | 78mm ant | 915Mhz | 78mm ant | 915Mhz | 165mm ant | 433Mhz | 82mm ant | 868Mhz | 78mm ant | 915Mhz